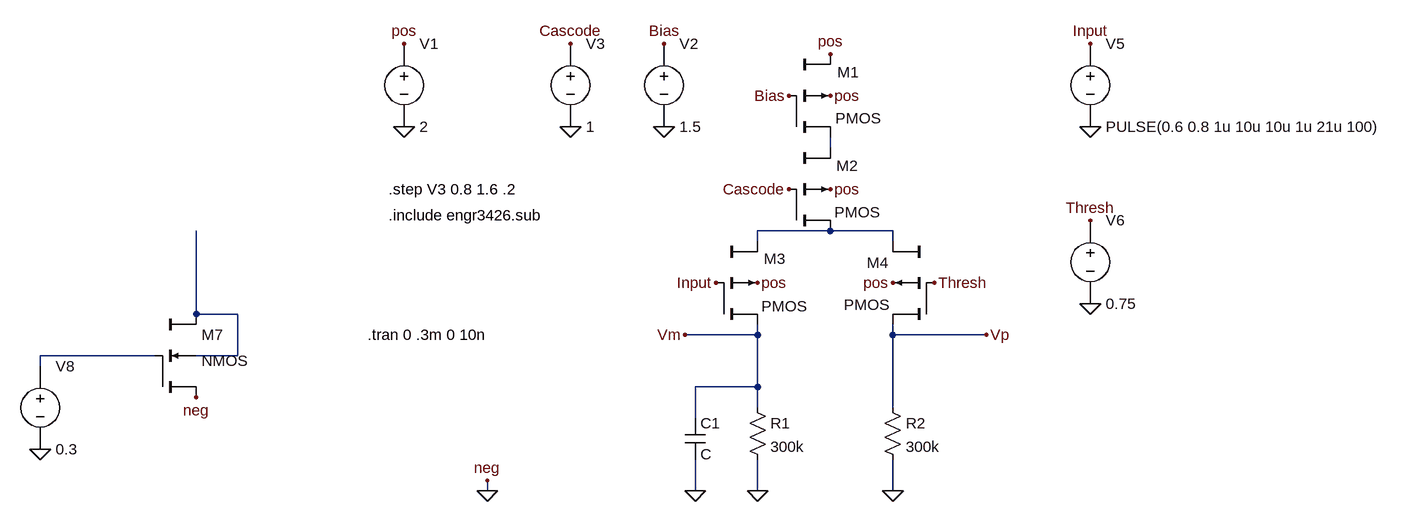
[diagram p0: schematic comparator_preamp_Amy.asc]
comparator_preamp_Amy.asc, the LTspice schematic file:
Version 4
SHEET 1 1144 796
WIRE 208 176 208 160
WIRE 208 304 96 304
WIRE 304 304 208 304
WIRE 96 320 96 304
WIRE 304 320 304 304
WIRE -768 432 -768 304
WIRE -704 432 -768 432
WIRE 96 464 96 448
WIRE 96 464 -16 464
WIRE 304 464 304 448
WIRE 448 464 304 464
WIRE -832 496 -1008 496
WIRE -704 496 -704 432
WIRE -704 496 -768 496
WIRE -1008 512 -1008 496
WIRE 96 544 96 464
WIRE 96 544 0 544
WIRE 96 576 96 544
WIRE 304 576 304 464
WIRE 0 592 0 544
WIRE -320 704 -320 688
WIRE 0 704 0 656
WIRE 96 704 96 656
WIRE 304 704 304 656
FLAG 96 384 pos
FLAG 304 384 pos
FLAG 208 240 pos
FLAG 208 96 pos
FLAG 208 32 pos
FLAG 32 384 Input
FLAG 368 384 Thresh
FLAG 144 240 Cascode
FLAG 144 96 Bias
FLAG 448 464 Vp
FLAG -16 464 Vm
FLAG -448 144 0
FLAG -192 144 0
FLAG -48 144 0
FLAG -192 16 Cascode
FLAG -48 16 Bias
FLAG 608 144 0
FLAG 608 416 0
FLAG 608 16 Input
FLAG -448 16 pos
FLAG 608 288 Thresh
FLAG -320 704 0
FLAG -320 688 neg
FLAG -768 560 neg
FLAG -1008 640 0
FLAG 96 704 0
FLAG 304 704 0
FLAG 0 704 0
SYMBOL cktsym\\pmos4 208 96 R0
WINDOW 0 11 -36 Left 2
WINDOW 3 8 35 Left 2
SYMATTR InstName M1
SYMATTR Value2 l=4u w=16u
SYMBOL cktsym\\pmos4 208 240 R0
WINDOW 0 9 -36 Left 2
WINDOW 3 6 35 Left 2
SYMATTR InstName M2
SYMATTR Value2 l=.8u w=3.2u
SYMBOL cktsym\\pmos4 96 384 R0
WINDOW 0 10 -37 Left 2
WINDOW 3 6 36 Left 2
SYMATTR InstName M3
SYMATTR Value2 l=1u w=3u
SYMBOL cktsym\\pmos4 304 384 M0
WINDOW 0 6 -31 Left 2
WINDOW 3 5 34 Left 2
SYMATTR InstName M4
SYMATTR Value2 l=1u w=3u
SYMBOL cktsym\\vsource -448 80 R0
WINDOW 123 0 0 Left 2
WINDOW 39 0 0 Left 2
SYMATTR Value 2
SYMATTR InstName V1
SYMBOL cktsym\\vsource -48 80 R0
WINDOW 123 0 0 Left 2
WINDOW 39 0 0 Left 2
SYMATTR Value 1.5
SYMATTR InstName V2
SYMBOL cktsym\\vsource -192 80 R0
WINDOW 123 0 0 Left 2
WINDOW 39 0 0 Left 2
SYMATTR Value 1
SYMATTR InstName V3
SYMBOL cktsym\\vsource 608 80 R0
WINDOW 123 0 0 Left 2
WINDOW 39 0 0 Left 2
SYMATTR Value PULSE(0.6 0.8 1u 10u 10u 1u 21u 100)
SYMATTR InstName V5
SYMBOL cktsym\\vsource 608 352 R0
WINDOW 123 0 0 Left 2
WINDOW 39 0 0 Left 2
SYMATTR Value 0.75
SYMATTR InstName V6
SYMBOL cktsym\\nmos4 -768 496 R0
SYMATTR InstName M7
SYMBOL cktsym\\vsource -1008 576 R0
WINDOW 123 0 0 Left 2
WINDOW 39 0 0 Left 2
SYMATTR Value 0.3
SYMATTR InstName V8
SYMBOL res 80 560 R0
SYMATTR InstName R1
SYMATTR Value 300k
SYMBOL res 288 560 R0
SYMATTR InstName R2
SYMATTR Value 300k
SYMBOL cap -16 592 R0
SYMATTR InstName C1
TEXT -504 464 Left 2 !.tran 0 .3m 0 10n
TEXT -472 280 Left 2 !.include engr3426.sub
TEXT -472 240 Left 2 !.step V3 0.8 1.6 .2

The netlist it stands for:
* comparator_preamp_Amy.asc
M1 N001 Bias pos pos PMOS l=4u w=16u
M2 N002 Cascode N001 pos PMOS l=.8u w=3.2u
M3 Vm Input N002 pos PMOS l=1u w=3u
M4 Vp Thresh N002 pos PMOS l=1u w=3u
V1 pos 0 2
V2 Bias 0 1.5
V3 Cascode 0 1
V5 Input 0 PULSE(0.6 0.8 1u 10u 10u 1u 21u 100)
V6 Thresh 0 0.75
M7 N003 N004 0 N003 NMOS
V8 N004 0 0.3
R1 Vm 0 300k
R2 Vp 0 300k
C1 Vm 0 C
.model NMOS NMOS
.model PMOS PMOS
.lib standard.mos
.tran 0 .3m 0 10n
.include engr3426.sub
.step V3 0.8 1.6 .2
.backanno
.end